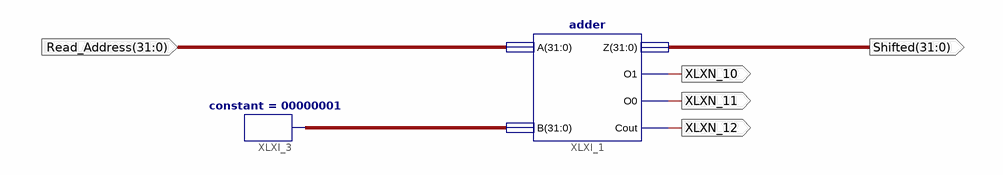
[diagram p0: schematic sheet 1]
// Xilinx ISE schematic Adder1.sch (xa9500xl) as structural Verilog: 2 symbols, 5 ports
module Adder1 (
  input  [31:0] Read_Address,
  output XLXN_10,
  output XLXN_11,
  output XLXN_12,
  output [31:0] Shifted
);

  wire [31:0] XLXN_14;

  adder XLXI_1 (.A(Read_Address), .B(XLXN_14), .Z(Shifted), .O1(XLXN_10), .O0(XLXN_11), .Cout(XLXN_12));
  constant #(.CValue("00000001")) XLXI_3 (.O(XLXN_14));
endmodule
